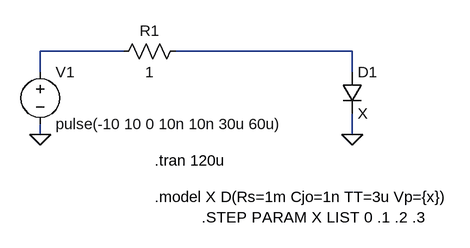
[diagram p0: schematic Fig_2-123_Softrecovery.asc]
Fig_2-123_Softrecovery.asc, the LTspice schematic file:
Version 4
SHEET 1 880 680
WIRE 64 64 -64 64
WIRE 416 64 144 64
WIRE -64 96 -64 64
WIRE 416 96 416 64
WIRE -64 192 -64 176
WIRE 416 192 416 160
FLAG 416 192 0
FLAG -64 192 0
SYMBOL diode 400 96 R0
SYMATTR InstName D1
SYMATTR Value X
SYMBOL voltage -64 80 R0
SYMATTR InstName V1
SYMATTR Value pulse(-10 10 0 10n 10n 30u 60u)
SYMBOL res 160 48 R90
WINDOW 0 0 56 VBottom 2
WINDOW 3 32 56 VTop 2
SYMATTR InstName R1
SYMATTR Value 1
TEXT 112 288 Left 2 !.model X D(Rs=1m Cjo=1n TT=3u Vp={x})
TEXT 112 232 Left 2 !.tran 120u
TEXT 184 320 Left 2 !.STEP PARAM X LIST 0 .1 .2 .3

The netlist it stands for:
* Fig_2-123_Softrecovery.asc
D1 N002 0 X
V1 N001 0 pulse(-10 10 0 10n 10n 30u 60u)
R1 N002 N001 1
.model D D
.lib standard.dio
.model X D(Rs=1m Cjo=1n TT=3u Vp={x})
.tran 120u
.STEP PARAM X LIST 0 .1 .2 .3
.backanno
.end